# EAGLE design HPA_Module_V1p1 (EAGLE 9.6.2)
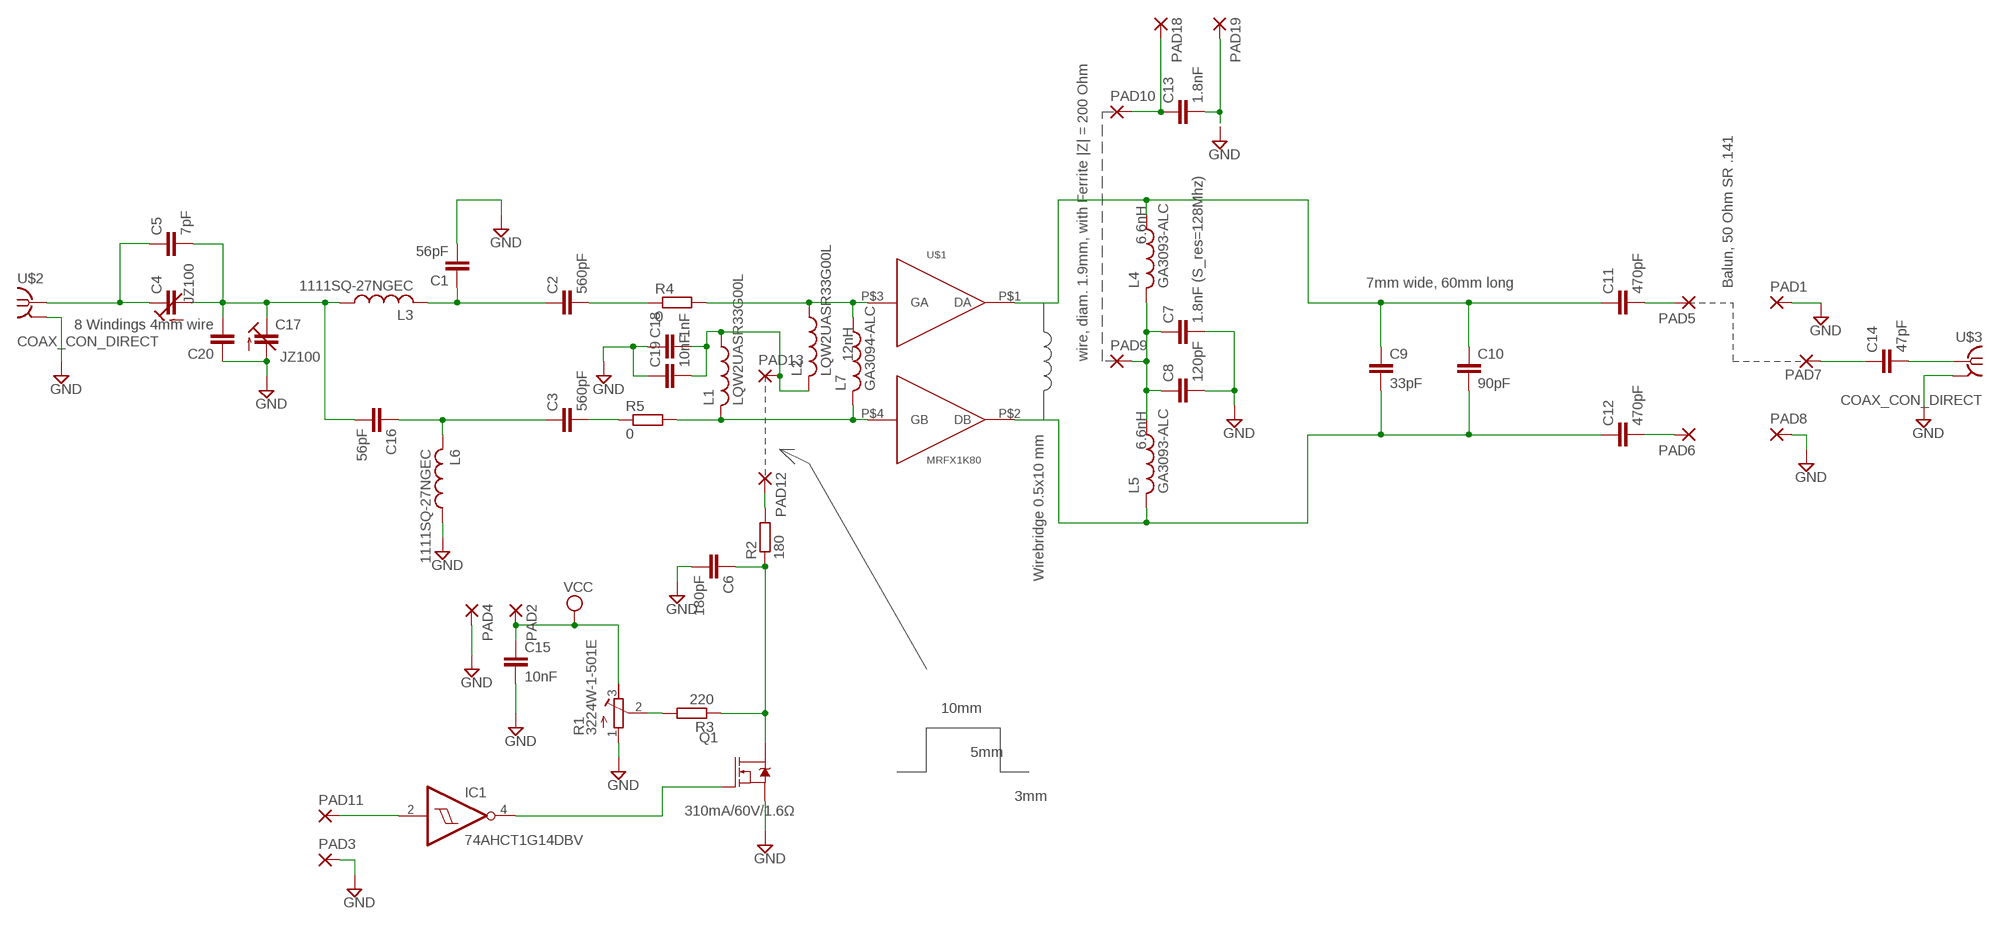
[diagram p0: schematic, sheet 1]

## Parts
C1  56pF  C-EUC1210  [C1210]
C2  560pF  C-EUC1210  [C1210]
C3  560pF  C-EUC1210  [C1210]
C4  JZ100  C-TRIMM3018_12  [CTRIM3018_12]
C5  7pF  C-EUC1210K  [C1210K]
C6  180pF  C-EUC0805  [C0805]
C7  1.8nF (S_res=128Mhz)  C-EUC1210  [C1210]
C8  120pF  C-EUC1210  [C1210]
C9  33pF  C-EUC2220K  [C2220K]
C10  90pF  C-EUC2220K  [C2220K]
C11  470pF  C-EUC1210  [C1210]
C12  470pF  C-EUC1210  [C1210]
C13  1.8nF  C-EUC1210  [C1210]
C14  47pF  C-EUC1210  [C1210]
C15  10nF  C-EUC0805  [C0805]
C16  56pF  C-EUC1210  [C1210]
C17  JZ100  C-TRIMM3018_12  [CTRIM3018_12]
C18  1nF  C-EUC0805  [C0805]
C19  10nF  C-EUC0805  [C0805]
C20  8 Windings 4mm wire  C-EUC1210K  [C1210K]
IC1  74AHCT1G14DBV  [SOT23-5]
L1  LQW2UASR33G00L  L-USL2825P  [L2825P]
L2  LQW2UASR33G00L  L-USL2825P  [L2825P]
L3  1111SQ-27NGEC  L-USL2825P  [L2825P]
L4  GA3093-ALC  L-USL4532P  [L4532P]
L5  GA3093-ALC  L-USL4532P  [L4532P]
L6  1111SQ-27NGEC  L-USL2825P  [L2825P]
L7  GA3094-ALC  L-USL4532P  [L4532P]
PAD1  SMD5  [SMD2,54-5,08]
PAD2  SMD5  [SMD2,54-5,08]
PAD3  SMD5  [SMD2,54-5,08]
PAD4  SMD5  [SMD2,54-5,08]
PAD5  SMD5  [SMD2,54-5,08]
PAD6  SMD5  [SMD2,54-5,08]
PAD7  SMD5  [SMD2,54-5,08]
PAD8  SMD5  [SMD2,54-5,08]
PAD9  SMD5  [SMD2,54-5,08]
PAD10  SMD5  [SMD2,54-5,08]
PAD11  SMD5  [SMD2,54-5,08]
PAD12  SMD5  [SMD2,54-5,08]
PAD13  SMD5  [SMD2,54-5,08]
PAD18  SMD5  [SMD2,54-5,08]
PAD19  SMD5  [SMD2,54-5,08]
Q1  310mA/60V/1.6Ω  MOSFET-NCH-2N7002PW  [SOT323]
R1  3224W-1-501E  R-TRIMM3224W  [RTRIM3224W]
R2  180  R-EU_R0805  [R0805]
R3  220  R-EU_R0805  [R0805]
R4  0  R-EU_R1206  [R1206]
R5  0  R-EU_R1206  [R1206]
U$1  MRFX1K80  [NI-1230H-4S]
U$2  COAX_CON_DIRECT  [COAX.141]
U$3  COAX_CON_DIRECT  [COAX.141]

## Nets
GND: C1.2 C6.2 C7.2 C8.2 C13.2 C15.2 C17.-(A) C18.1 C19.1 C20.1 L6.1 PAD1.1(P) PAD3.1(P) PAD4.1(P) PAD8.1(P) PAD19.1(P) Q1.2(S) R1.1(A) U$2.P$2(GND) U$3.P$2(GND)
N$1: L1.2 L7.2 R5.2 U$1.P$4(GB)
N$2: L2.1 L7.1 R4.2 U$1.P$3(GA)
N$3: C18.2 C19.2 L1.1 L2.2 PAD13.1(P)
N$4: C9.1 C10.1 C11.1 L4.1 U$1.P$1(DA)
N$5: C1.1 C2.1 L3.2
N$6: C3.1 C16.1 L6.2
N$7: C4.-(A) C5.2 C16.2 C17.+(E) C20.2 L3.1
N$8: C9.2 C10.2 C12.1 L5.2 U$1.P$2(DB)
N$9: C4.+(E) C5.1 U$2.P$1
N$10: C7.1 C8.1 L4.2 L5.1 PAD9.1(P)
N$11: C6.1 Q1.3(D) R2.1 R3.1
N$12: C11.2 PAD5.1(P)
N$13: C12.2 PAD6.1(P)
N$14: C13.1 PAD10.1(P) PAD18.1(P)
N$15: R1.2(S) R3.2
N$16: C14.1 PAD7.1(P)
N$17: C14.2 U$3.P$1
N$18: IC1.4(O) Q1.1(G)
N$19: PAD12.1(P) R2.2
N$20: IC1.2(I) PAD11.1(P)
N$21: C2.2 R4.1
N$22: C3.2 R5.1
VCC: C15.1 PAD2.1(P) R1.3(E)

## Notes on the sheet
- |Z| = 200 Ohm
- 6.6nH
- 7mm wide, 60mm long | Balun, 50 Ohm SR .141
- 12nH | wire, diam. 1.9mm, with Ferrite
- 6.6nH
- Wirebridge 0.5x10 mm
- 10mm
- 5mm
- 3mm

## Power pins joined to a net without a drawn wire
GND: IC1.3(GND)
VCC: IC1.5(VCC)

## Library data of the parts
C1-C3 C5-C16 C18-C20 = rcl:C-EU: CAPACITOR, European symbol; SPICEPREFIX: C
C4 C17 = rcl:C-TRIMM: Trimm capacitor; SPICEPREFIX: C
IC1 = 74xx-little-us:74*1G14: Single Schmitt-Trigger Inverter Gate
L1-L7 = rcl:L-US: INDUCTOR, American symbol; SPICEPREFIX: L
PAD1-PAD13 PAD18 PAD19 = wirepad:SMD5: SMD PAD
Q1 = SparkFun-DiscreteSemi:MOSFET-NCH: N-channel MOSFETs Voltage controlled devices that allow control of high current outputs. SparkFun Products: SparkFun OpenScale <https://www.sparkfun.com/products/13261> SparkFun Digital Sandbox <https://www.sparkfun.com/products/12651> SparkFun Monster Moto Shield <https://www.sparkfun.com/products/10182> SparkFun MOSFET Power Controller <https://www.sparkfun.com/products/11214>; PROD_ID: TRANS-11151
R1 = rcl:R-TRIMM: Trimm resistor; SPICEMODEL: X; SPICEPREFIXL: POT
R2-R5 = rcl:R-EU_: RESISTOR, European symbol; SPICEPREFIX: R
U$1 = Orzada:MRFX1K80: RF Power Amplifier MRFX1K80H
U$2 U$3 = Orzada:COAX_CON_DIRECT: Direct Coax to Bord Top

## Board
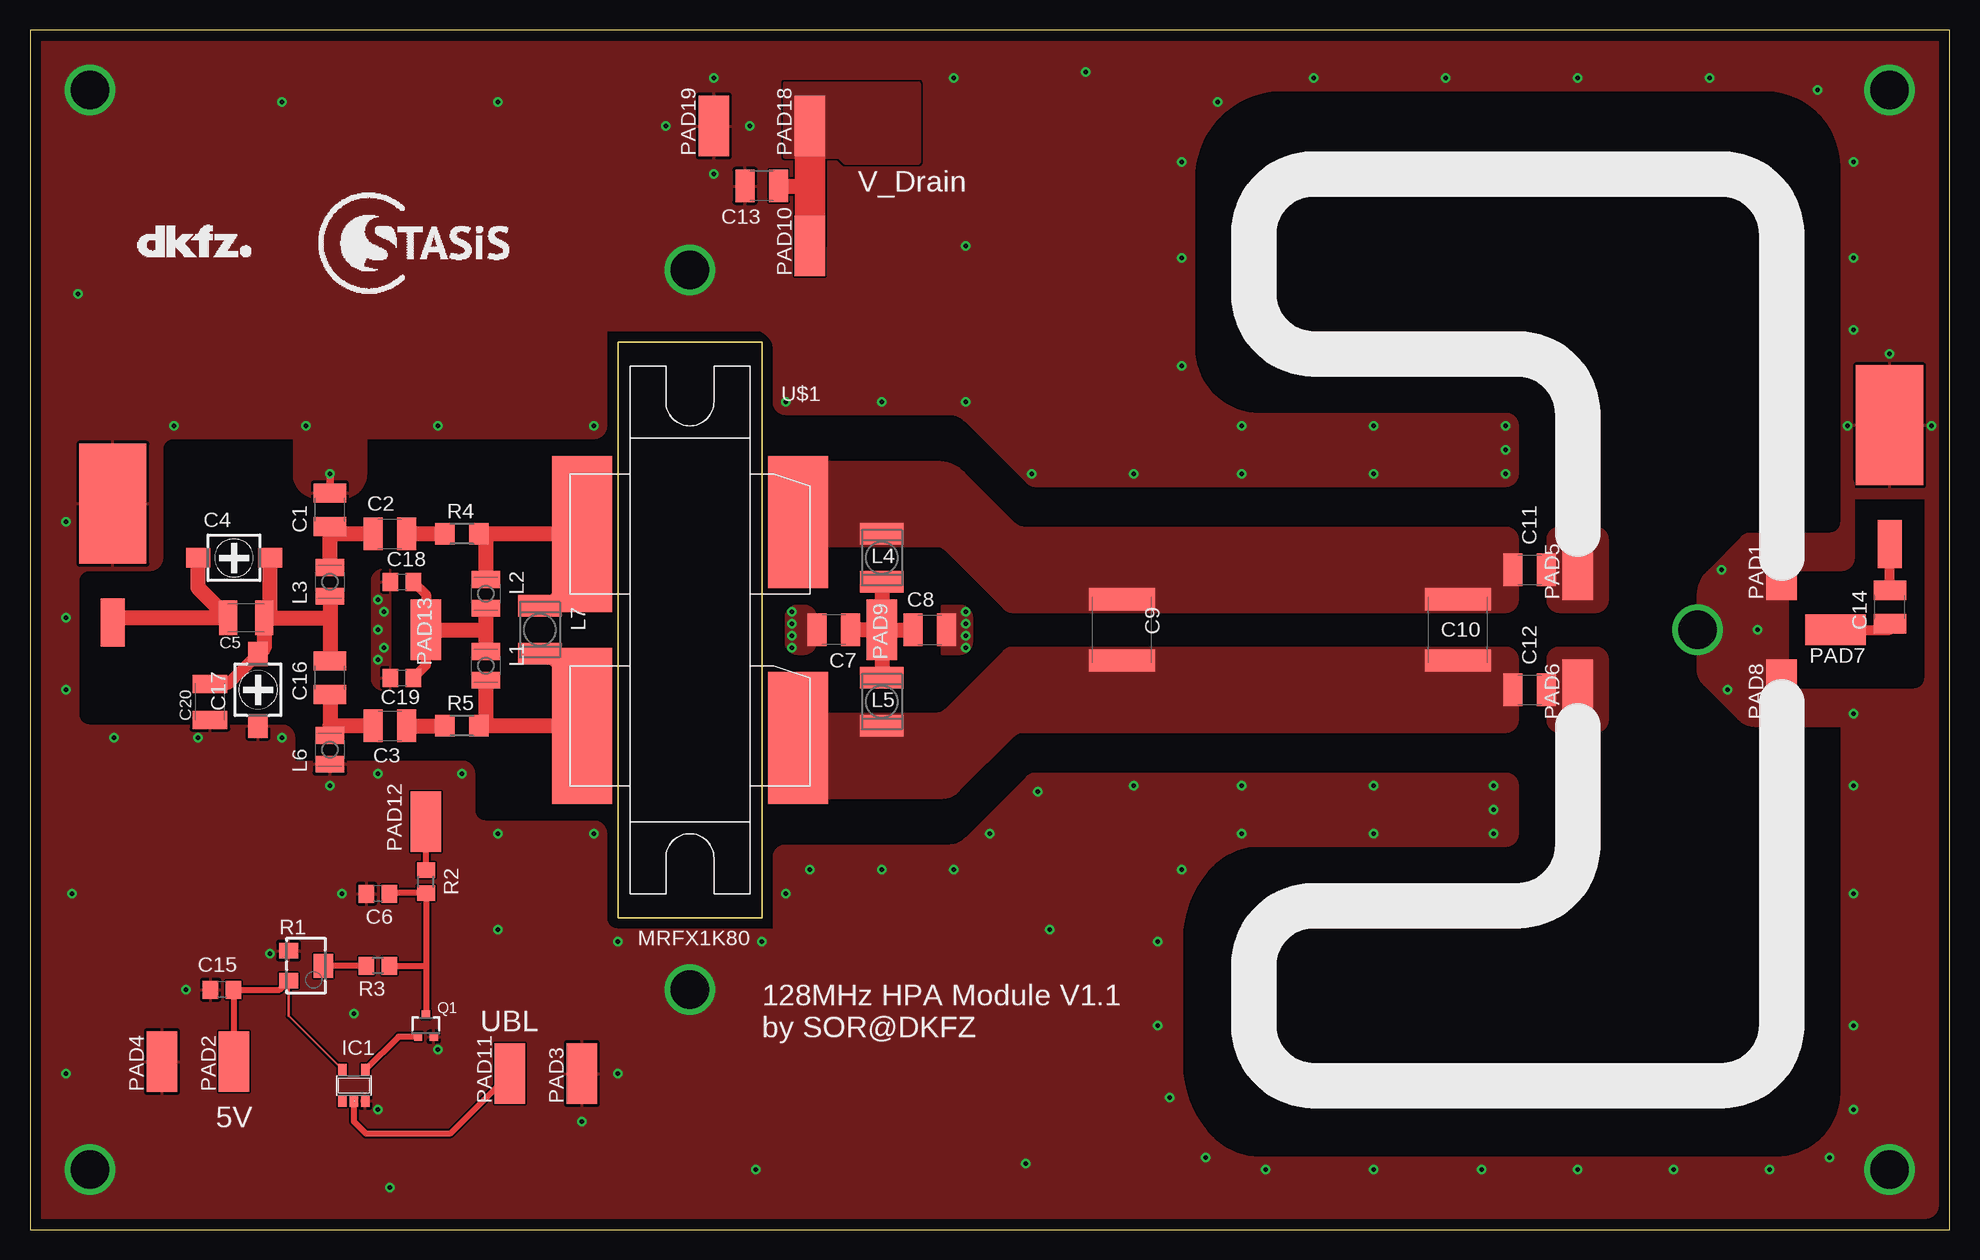
[diagram p1: board, top side]
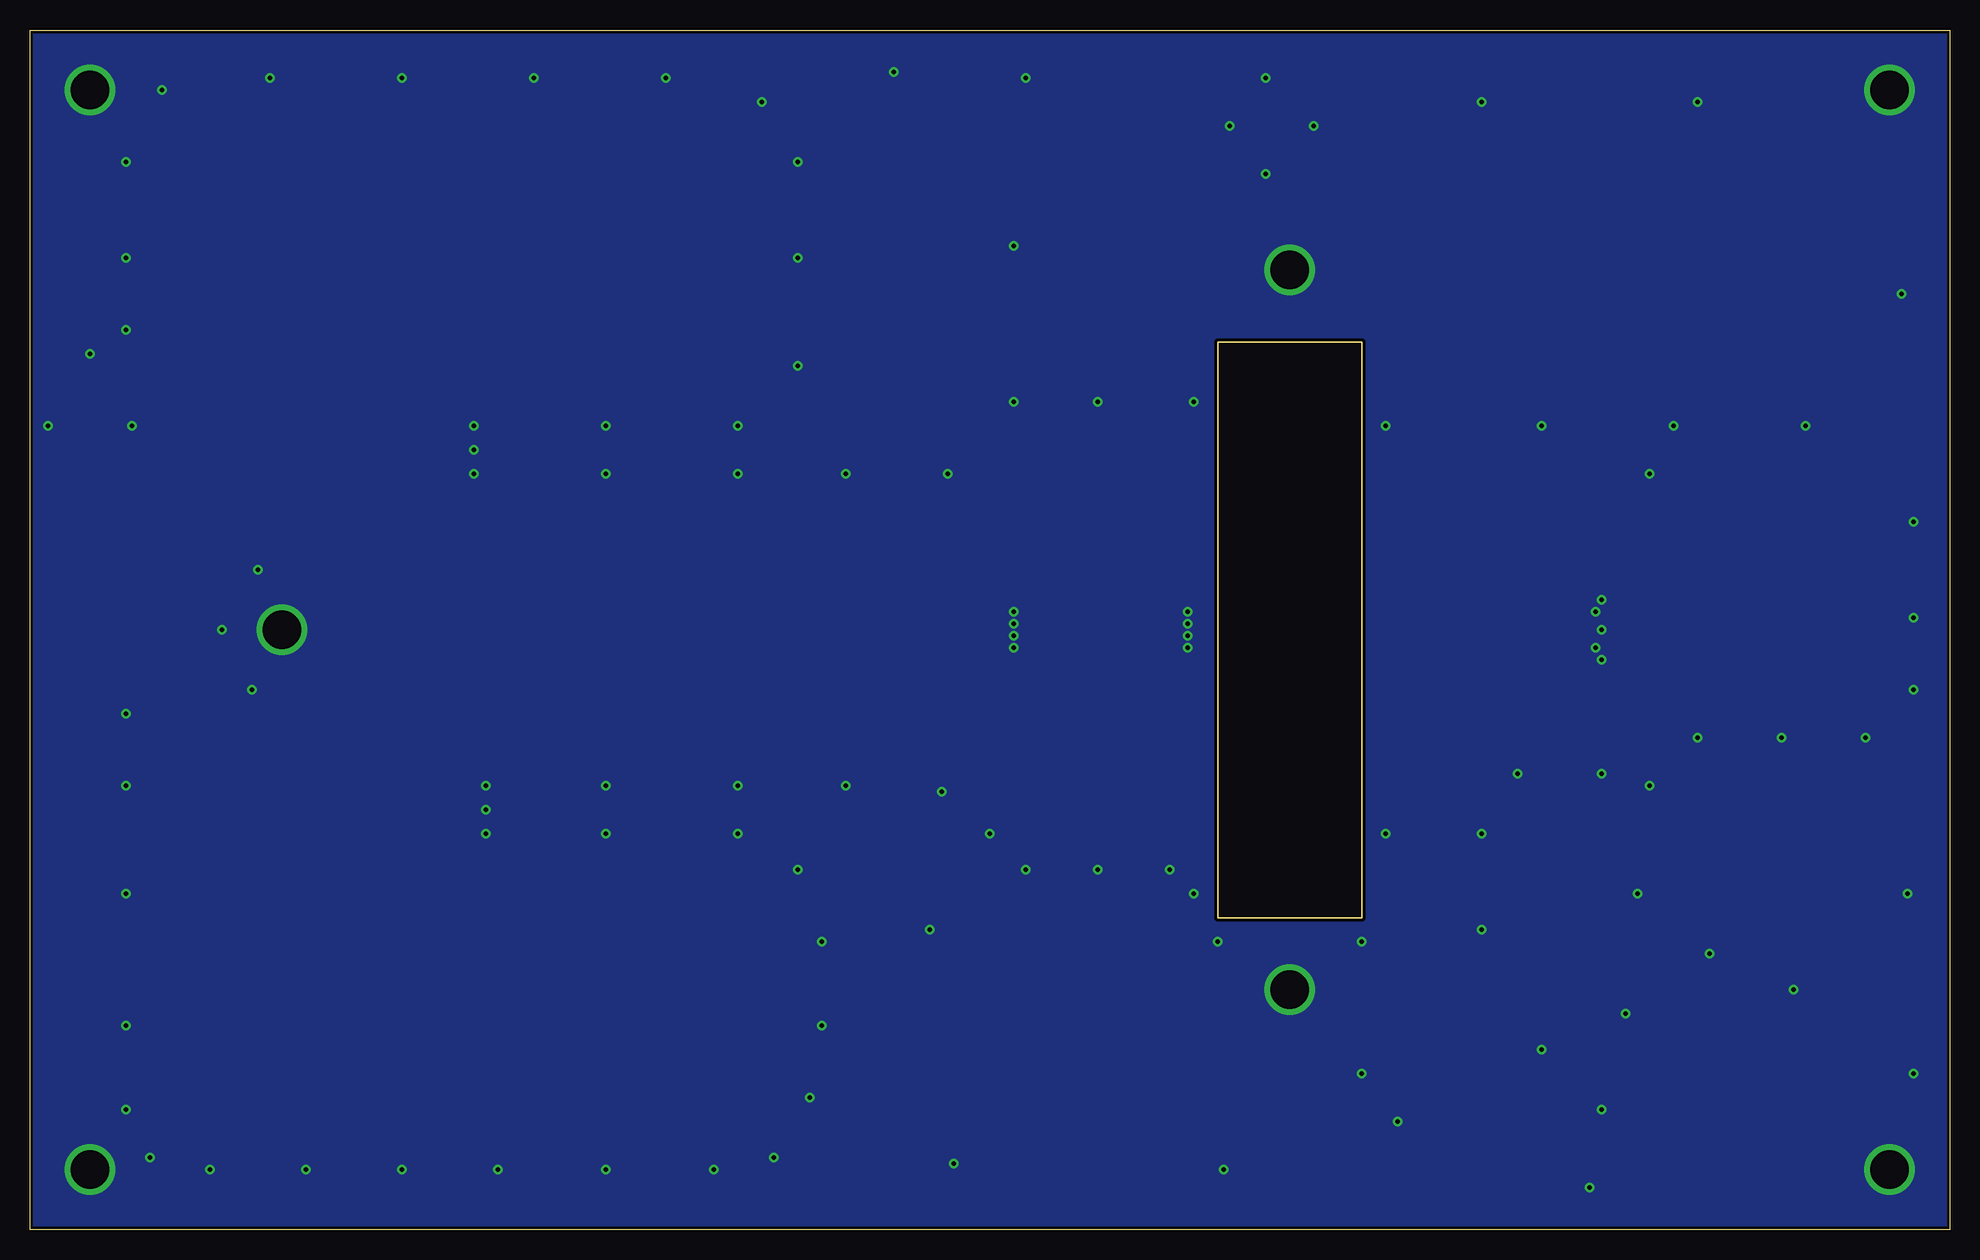
[diagram p2: board, bottom side, seen from below]

Size 160 x 100 mm. Coordinates in mm from the lower left corner, seen from the top.
Outline: 0,0 160,0 160,100 0,100 0,0
Copper layers (1*16): Top 0.035mm / dielectric 0.8mm / Bottom 0.035mm
Design rules "default *": minimum track width 6mil, minimum drill 0.35mm, track to track 6mil, track to pad 6mil, pad to pad 6mil, via to via 6mil, smd to smd 6mil, copper to edge 10mil, drill to drill 6mil, minimum pad ring 10mil, minimum via ring 8mil, stop-mask expansion 4mil, vias tented up to drill 0mil, thermal gap 10mil

### Footprints (pad centres in the part's own frame; a part is rotated, then mirrored left to right if it is on the bottom)
C1210 = smd 1.6 x 2.7: 1 -1.4,0; 2 1.4,0
CTRIM3018_12 = smd 2 x 1.6: + -3,0; - 3,0
C1210K = smd 1.5 x 2.9: 1 -1.5,0; 2 1.5,0
C0805 = smd 1.3 x 1.5: 1 -0.95,0; 2 0.95,0
C2220K = smd 1.85 x 5.5: 1 -2.55,0; 2 2.55,0
SOT23-5 = smd 0.69 x 0.99: 1 -0.95,-1.29; 2 0,-1.29; 3 0.95,-1.29; 4 0.95,1.3; 5 -0.95,1.3
L2825P = smd 1.4 x 2.4: 1 -1.2,0; 2 1.2,0
L4532P = smd 1.8 x 3.6: 1 -2,0; 2 2,0
SMD2,54-5,08 = smd 2.54 x 5.08: 1 0,0
SOT323 = smd 0.7 x 0.7: 1 -0.65,-0.925; 2 0.65,-0.925; 3 0,0.925
RTRIM3224W = smd 1.3 x 1.6: 1 -1.25,-1.45; 3 1.25,-1.45 | smd 2 x 1.6: 2 0,1.45
R0805 = smd 1.3 x 1.5: 1 -0.95,0; 2 0.95,0
R1206 = smd 1.6 x 1.803: 1 -1.422,0; 2 1.422,0
NI-1230H-4S = smd 5 x 11: P$1 9,9; P$2 9,-9 | smd 5 x 13: P$3 -9,8; P$4 -9,-8
COAX.141 = smd 4 x 2: P$1 -3.364,0 | smd 10 x 5.588: P$2 6.546,0

### Placement (x,y rotation side)
C1  25,60 90 top
C2  30,58 0 top
C3  30,42 0 top
C4  17,56 0 top
C5  18,51 0 top
C6  29,28 180 top
C7  67,50 180 top
C8  75,50 0 top
C9  91,50 270 top
C10  119,50 270 top
C11  125,55 0 top
C12  125,45 0 top
C13  61,87 180 top
C14  155.03,51.9 90 top
C15  16,20 180 top
C16  25,46 90 top
C17  19,45 270 top
C18  31,54 0 top
C19  31,46 0 top
C20  15,44 90 top
IC1  27,12 0 top
L1  38,47 270 top
L2  38,53 270 top
L3  25,54 90 top
L4  71,56 270 top
L5  71,44 270 top
L6  25,40 90 top
L7  42.5,50 270 top
PAD1  146,55 0 top
PAD2  17,14 0 top
PAD3  46,13 0 top
PAD4  11,14 0 top
PAD5  129,55 0 top
PAD6  129,45 0 top
PAD7  150.5,50 90 top
PAD8  146,45 0 top
PAD9  71,50 0 top
PAD10  65,82 0 top
PAD11  40,13 0 top
PAD12  33,34 0 top
PAD13  33,50 0 top
PAD18  65,92 0 top
PAD19  57,92 0 top
Q1  33,17 0 top
R1  23,22 270 top
R2  33,29 90 top
R3  29,22 180 top
R4  36,58 0 top
R5  36,42 0 top
U$1  55,50 0 top
U$2  6.91,53.96 90 top
U$3  155,60.5 90 top
U$4  [LOGO_DKFZ]  9,81 0 top
U$5  [LOGO_STASIS]  33,82 0 top

### Tracks (layer width: path | path; a pad name or v marks a point on that pad's centre or on a via)
GND  (via drill 0.35, 3.2)
  Top 0.61: C1.2 v25,63
  other vias: 63.5,51.5 63.5,50.5 63.5,49.5 63.5,48.5 78,51.5 78,50.5 78,49.5 78,48.5 29,52.5 29,50 29,47.5 29.5,48.5 29.5,51.5 5,95 5,5 155,5 155,95 55,80 55,20 139,50 122,35 122,37 84,36.5 92,37 101,37 112,37 122,33 112,33 101,33 123,65 123,67 123,63 83.5,63 92,63 101,63 112,63 112,67 101,67 96,30 94,24 94,17 95,11 98,6 103,5 112,5 121,5 129,5 137,5 145,5 150,6 152,10 152,17 152,28 152,37 152,43 144,50 80,33 77,30 71,30 65,30 63,28 61,24 49,24 47,33 36,38 21,41 25,37 29,38 26,28 13,20 20,23 34,15 29,10 49,13 46,9 27,18 39,25 39,33 14,41 7,41 3,45 3,51 3,59 47,67 63,69 71,69 78,69 96,72 96,81 96,89 99,94 107,96 118,96 129,96 140,96 149,95 152,89 152,81 152,75 57,96 60,92 57,88 53,92 77,96 78,82 39,94 21,94 34,67 23,67 12,67 155,73 158.5,67 151.5,67 83,5.5 60.5,5 30,3.5 3.5,28 3,13 4,78 88,96.5 85,25 141.5,45 141,55
  pour Bottom: 0,100 160,100 160,0 0,0
  pour Top (no thermals): 76,52 77.5,52 arc-90 78.5,51 78.5,50 78.5,49 arc-90 77.5,48 76,48
  pour Top (no thermals): 65.5,50 65.5,51 arc90 64.5,52 64,52 arc90 63,51 63,50 63,49 arc90 64,48 64.5,48 arc90 65.5,49
  pour Top: 30,46 30,55 29.5,55 arc90 28.5,54 28.5,46 arc90 29.5,45 30,45
  pour Top (no thermals): 146,58 143.41,58 arc45 142.71,57.71 140,55 140,55 arc45 139,52.59 139,46.83 arc45 139.59,45.41 142.41,42.59 arc45 143.83,42 146,42 arc90 146.5,42.5 146.5,57.5 arc90
  pour Top (rank 2): 61.29,74.71 61.71,74.29 arc-45 62,73.59 62,69 arc90 63,68 76.59,68 arc-45 78,67.41 83.12,62.29 arc45 83.83,62 123,62 arc90 124,63 124,67 arc90 123,68 102.41,68 arc-45 98.63,69.57 arc-45 97,73.5 97,87.59 arc-45 99.17,92.83 arc-45 104.41,95 144.59,95 arc-45 149.12,93.12 arc-45 151,88.59 151,61 159,61 159,99 1,99 1,76 1.71,75.29 arc45 2.41,75 60.59,75 arc-45
  pour Top (no thermals): 62,2 62,31 arc-90 63,32 76.59,32 arc45 78,32.59 83.12,37.71 arc-45 83.83,38 123,38 arc-90 124,37 124,33 arc-90 123,32 102.41,32 arc45 98.59,30.41 arc45 96,24.17 96,13.83 arc45 98.59,7.59 arc45 102.41,6 145.59,6 arc45 149.41,7.59 arc45 151,11.41 151,44 arc-90 152,45 157,45 arc90 158,46 158,61 159,61 159,2 arc-90 158,1 63,1 arc-90
  pour Top (no thermals): 151,42 146,42 arc-90 145,43 145,44 arc-90 146,45 152,45 152,43 arc-90
  pour Top (no thermals): 146,55 151,55 arc90 152,56 152,62 arc90 151,63 151,59 arc-90 150,58 146,58
  pour Top: 63,1 1,1 1,76 48,76 48,67 arc-90 47,66 12,66 arc90 11,65 11,56 arc-90 10,55 5,55 arc90 4,54 4,46 4,43 arc90 5,42 21,42 arc-90 22,41 22,39 36,39 arc-90 37,38 37,35 arc90 38,34 47,34 arc-90 48,33 48,26 arc90 49,25 63,25
  pour Top: 24,61 arc-90 22,63 22,67 28,67 28,63 arc-90 26,61
N$1
  Top 0.152: L7.2 46,44.5 U$1.P$4
  Top 1.27: U$1.P$4 R5.2 38,42.58 L1.2
N$2
  Top 0.152: L7.1 46,55.5 U$1.P$3
  Top 1.27: U$1.P$3 38,58 | 38,58 R4.2 | L2.1 38,58
N$3
  Top 0.813: C18.2 33,52.95 PAD13.1 | PAD13.1 33,49 | C19.2 33,47.05 PAD13.1
  Top 1.27: L1.1 38,50 | 38,50 L2.2 | PAD13.1 38,50
N$4
  pour Top (no thermals): 66,57 75.59,57 arc-45 76.29,56.71 81.21,51.79 arc45 81.91,51.5 123,51.5 arc90 124,52.5 124,57.5 arc90 123,58.5 82.83,58.5 arc-45 82.12,58.79 77.85,63.06 arc45 75.59,64 66,64
N$5
  Top 1.27: C2.1 25.6,58 C1.1 L3.2
N$6
  Top 1.27: C16.1 25,42 | 25,42 L6.2 | C3.1 25,42
N$7
  Top 1.016: C17.+ 16.5,45.5 C20.2
  Top 1.27: L3.1 25,51 | 25,51 C16.2 | C5.2 19.5,48.5 C17.+ | C5.2 25,51 | C5.2 20,51.5 C4.-
N$8
  pour Top (no thermals): 66,43 75.59,43 arc45 76.29,43.29 81.21,48.21 arc-45 81.91,48.5 123,48.5 arc-90 124,47.5 124,42.5 arc-90 123,41.5 82.74,41.5 arc45 82.04,41.21 77.41,36.59 arc-45 76,36 66,36
N$9
  Top 1.27: C4.+ 14,53.5 C5.1 6.91,51 U$2.P$1
N$10
  Top 1.27: L4.2 PAD9.1 | PAD9.1 L5.1 | PAD9.1 C8.1 | PAD9.1 C7.1
N$11
  Top 0.508: C6.1 29.95,28.05 R2.1 33,22 | 33,22 Q1.3 | R3.1 33,22
N$12
  pour Top (no thermals): 126.5,55 126.5,57.5 arc-90 127.5,58.5 129,58.5 130.5,58.5 arc-90 131.5,57.5 131.5,55 131.5,52.5 arc-90 130.5,51.5 129,51.5 127.5,51.5 arc-90 126.5,52.5
N$13
  pour Top (no thermals): 126.5,45 126.5,47.5 arc-90 127.5,48.5 129,48.5 130.5,48.5 arc-90 131.5,47.5 131.5,45 131.5,42.5 arc-90 130.5,41.5 129,41.5 127.5,41.5 arc-90 126.5,42.5
N$14
  Top 1.27: C13.1 65,87
  Top 2.54: PAD18.1 65,87 PAD10.1
  pour Top (no thermals): 63.5,95.5 74,95.5 74,89 68,89 67.5,89.5 63,89.5 63,95.5
N$15
  Top 0.508: R3.2 R1.2
N$16
  Top 0.813: PAD7.1 155.03,50 C14.1
N$17
  Top 0.813: C14.2 155.03,57.24 U$3.P$1
N$18
  Top 0.508: Q1.1 30.73,16.07 IC1.4
N$19
  Top 0.508: R2.2 PAD12.1
N$20
  Top 0.508: PAD11.1 35,8 28,8 27,9 IC1.2
N$21
  Top 1.27: R4.1 C2.2
N$22
  Top 1.27: C3.2 R5.1
VCC
  Top 0.2: R1.3 21.55,17.8 IC1.5
  Top 0.508: PAD2.1 17,19.95 C15.1 20.8,20 R1.3

### Text on the board
tPlace: V_Drain | UBL | 128MHz HPA Module V1.1 / by SOR@DKFZ | 5V